# Altium schematic sheet RS485.SchDoc
size A4
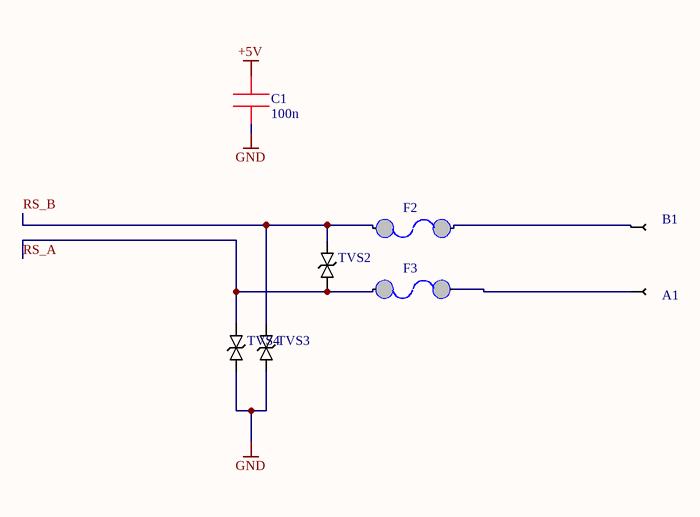
[diagram p0: RS485.SchDoc]

## Parts
A1  PIN_Wire  [PIN_wire]  (value not drawn)
B1  PIN_Wire  [PIN_wire]  (value not drawn)
C1  100n  [0402]
F2  Fuse PTS  [Fuse USMF005]  (value not drawn)
F3  Fuse PTS  [Fuse USMF005]  (value not drawn)
TVS2  SMAJ5.0CA  [DO-214AC]  (value not drawn)
TVS3  SMAJ5.0CA  [DO-214AC]  (value not drawn)
TVS4  SMAJ5.0CA  [DO-214AC]  (value not drawn)

## Nets
+5V: C1.2
GND: C1.1 TVS3.1 TVS4.1
RS_A: F3.0 TVS2.1 TVS4.2
RS_B: F2.0 TVS2.2 TVS3.2
NetA1_0: A1.0 F3.1
NetB1_0: B1.0 F2.1

## Library data of the parts
A1 B1 = PIN_Wire: pin
C1 = 0805 Cap: C1005X7R1H104K050BB
F2 F3 = Fuse PTS: MF-USMF005-2
TVS2-TVS4 = SMAJ5.0CA: SMAJ30CA